# Altium project SM2200-PCB-2.PrjPCB
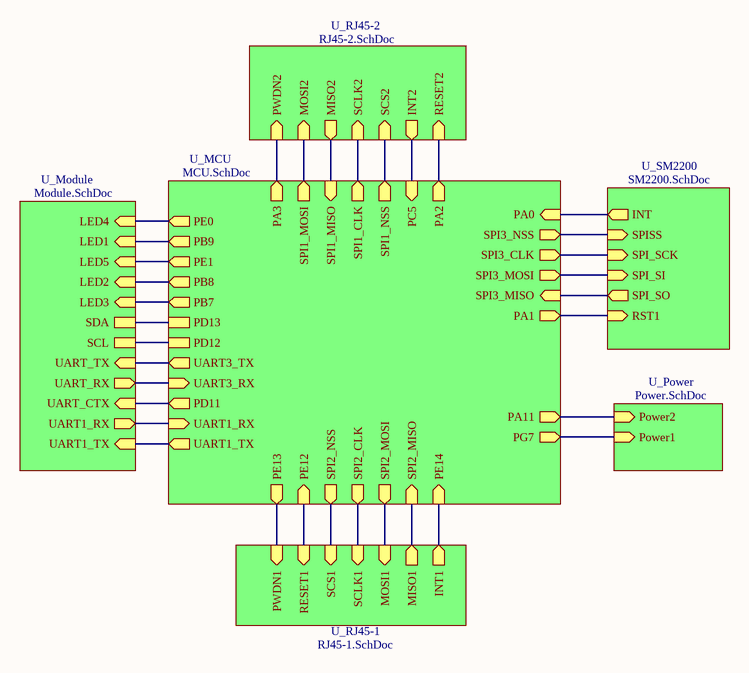
[diagram p0: Top.SchDoc]
7 sheets, 308 parts. Net scope: hierarchical (ports join the sheet entries above them; power ports are global).
Board file: Board.PcbDoc
Sheets:
  Top.SchDoc
    U_MCU = MCU.SchDoc
    U_Module = Module.SchDoc
    U_Power = Power.SchDoc
    U_RJ45-1 = RJ45-1.SchDoc
    U_RJ45-2 = RJ45-2.SchDoc
    U_SM2200 = SM2200.SchDoc

## Sheet Top.SchDoc
size A4

### Sub-sheets
U_MCU = MCU.SchDoc: SPI1_NSS (out), SPI1_CLK (out), SPI1_MISO (in), SPI1_MOSI (out), SPI2_NSS (out), SPI2_CLK (out), SPI2_MISO (in), SPI2_MOSI (out), PA3 (out), PC5 (in), PE14 (in), PE13 (out), PE12 (in), PA2 (out), PA1 (out), PA0 (in), UART1_TX (out), UART1_RX (in), UART3_TX (out), UART3_RX (in), PD11 (out), PD13, PD12, PG7 (out), PA11 (out), PE1 (out), PE0 (out), PB9 (out), PB8 (out), PB7 (out), SPI3_CLK (out), SPI3_MOSI (out), SPI3_NSS (out), SPI3_MISO (in)
U_Module = Module.SchDoc: UART_RX (out), UART_TX (in), UART_CTX (in), SCL, SDA, UART1_TX (in), UART1_RX (out), LED1 (in), LED2 (in), LED3 (in), LED4 (in), LED5 (in)
U_Power = Power.SchDoc: Power1 (in), Power2 (in)
U_RJ45-1 = RJ45-1.SchDoc: INT1 (out), SCS1 (in), SCLK1 (in), MOSI1 (in), MISO1 (out), PWDN1 (in), RESET1 (in)
U_RJ45-2 = RJ45-2.SchDoc: INT2 (out), SCS2 (in), SCLK2 (in), MOSI2 (in), MISO2 (out), PWDN2 (in), RESET2 (in)
U_SM2200 = SM2200.SchDoc: SPISS (in), SPI_SCK (in), SPI_SI (in), SPI_SO (out), RST1 (in), INT (out)

### Nets
INT: sheet U_MCU/PA0, sheet U_SM2200/INT
INT1: sheet U_MCU/PE14, sheet U_RJ45-1/INT1
INT2: sheet U_MCU/PC5, sheet U_RJ45-2/INT2
MISO1: sheet U_MCU/SPI2_MISO, sheet U_RJ45-1/MISO1
MISO2: sheet U_MCU/SPI1_MISO, sheet U_RJ45-2/MISO2
MOSI1: sheet U_MCU/SPI2_MOSI, sheet U_RJ45-1/MOSI1
MOSI2: sheet U_MCU/SPI1_MOSI, sheet U_RJ45-2/MOSI2
PWDN1: sheet U_MCU/PE13, sheet U_RJ45-1/PWDN1
PWDN2: sheet U_MCU/PA3, sheet U_RJ45-2/PWDN2
RESET1: sheet U_MCU/PE12, sheet U_RJ45-1/RESET1
RESET2: sheet U_MCU/PA2, sheet U_RJ45-2/RESET2
RST1: sheet U_MCU/PA1, sheet U_SM2200/RST1
SCLK1: sheet U_MCU/SPI2_CLK, sheet U_RJ45-1/SCLK1
SCLK2: sheet U_MCU/SPI1_CLK, sheet U_RJ45-2/SCLK2
SCS1: sheet U_MCU/SPI2_NSS, sheet U_RJ45-1/SCS1
SCS2: sheet U_MCU/SPI1_NSS, sheet U_RJ45-2/SCS2
SPI3_CLK: sheet U_MCU/SPI3_CLK, sheet U_SM2200/SPI_SCK
SPI3_MISO: sheet U_MCU/SPI3_MISO, sheet U_SM2200/SPI_SO
SPI3_MOSI: sheet U_MCU/SPI3_MOSI, sheet U_SM2200/SPI_SI
SPI3_NSS: sheet U_MCU/SPI3_NSS, sheet U_SM2200/SPISS
NetR10_2: sheet U_MCU/PD12, sheet U_Module/SCL
NetR11_1: sheet U_MCU/UART3_RX, sheet U_Module/UART_RX
NetR13_2: sheet U_MCU/PD13, sheet U_Module/SDA
NetR15_2: sheet U_MCU/PD11, sheet U_Module/UART_CTX
NetR18_1: sheet U_MCU/UART3_TX, sheet U_Module/UART_TX
NetR23_2: sheet U_MCU/PB7, sheet U_Module/LED3
NetR24_2: sheet U_MCU/PE0, sheet U_Module/LED4
NetR25_2: sheet U_MCU/PB9, sheet U_Module/LED1
NetR26_2: sheet U_MCU/PB8, sheet U_Module/LED2
NetR27_1: sheet U_MCU/UART1_TX, sheet U_Module/UART1_TX
NetR28_1: sheet U_MCU/UART1_RX, sheet U_Module/UART1_RX
NetR30_2: sheet U_MCU/PE1, sheet U_Module/LED5
NetR38_2: sheet U_MCU/PG7, sheet U_Power/Power1
NetR40_2: sheet U_MCU/PA11, sheet U_Power/Power2

## Sheet MCU.SchDoc
size A4
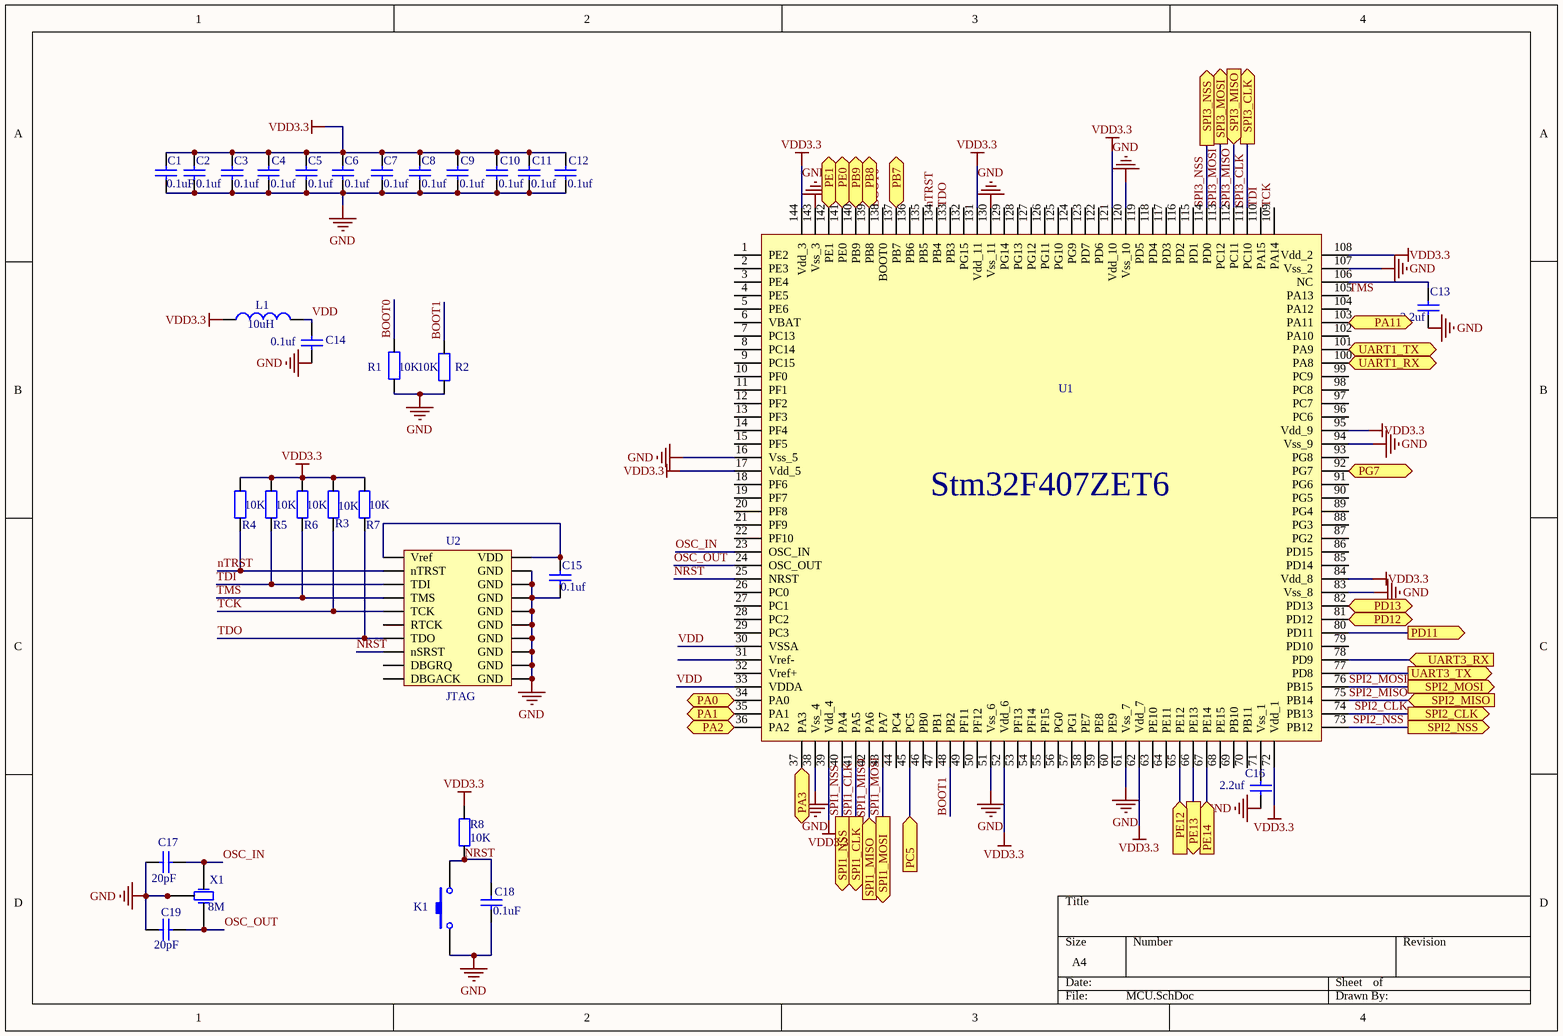
[diagram p1: MCU.SchDoc]

### Parts
C1  value 0.1uF  [0603]  (hidden comment: Capacitor-0805)
C2  value 0.1uf  [0603]  (hidden comment: Capacitor-0805)
C3  value 0.1uf  [0603]  (hidden comment: Capacitor-0805)
C4  value 0.1uf  [0603]  (hidden comment: Capacitor-0805)
C5  value 0.1uf  [0603]  (hidden comment: Capacitor-0805)
C6  value 0.1uf  [0603]  (hidden comment: Capacitor-0805)
C7  value 0.1uf  [0603]  (hidden comment: Capacitor-0805)
C8  value 0.1uf  [0603]  (hidden comment: Capacitor-0805)
C9  value 0.1uf  [0603]  (hidden comment: Capacitor-0805)
C10  value 0.1uf  [0603]  (hidden comment: Capacitor-0805)
C11  value 0.1uf  [0603]  (hidden comment: Capacitor-0805)
C12  value 0.1uf  [0603]  (hidden comment: Capacitor-0805)
C13  value 2.2uf  [0603]  (hidden comment: Capacitor-0603)
C14  value 0.1uf  [0603]  (hidden comment: Capacitor-0805)
C15  value 0.1uf  [0603]  (hidden comment: Capacitor-0805)
C16  value 2.2uf  [0603]  (hidden comment: Capacitor-0603)
C17  value 20pF  [0603]  (hidden comment: Capacitor-0805)
C18  value 0.1uF  [0603]  (hidden comment: Capacitor-0805)
C19  value 20pF  [0603]  (hidden comment: Capacitor-0805)
K1  按键  [贴片按键]  (value not drawn)
L1  value 10uH  [0805]  (hidden comment: Inductor)
R1  value 10K  [0603]  (hidden comment: Resistor-0805)
R2  value 10K  [0603]  (hidden comment: Resistor-0805)
R3  value 10K  [0603]  (hidden comment: Resistor-0805)
R4  value 10K  [0603]  (hidden comment: Resistor-0805)
R5  value 10K  [0603]  (hidden comment: Resistor-0805)
R6  value 10K  [0603]  (hidden comment: Resistor-0805)
R7  value 10K  [0603]  (hidden comment: Resistor-0805)
R8  value 10K  [0603]  (hidden comment: Resistor-0805)
U1  STM32F407ZET6  [Stm32f407ZET6 - duplicate]  (value not drawn)
U2  JTAG  [JTAG-20]
X1  value 8M  [3225无源晶振]  (hidden comment: 3225无源晶振)

### Ports
PA0 (in), PA1 (out), PA2 (out), PA3 (out), PA11 (out), PB7 (out), PB8 (out), PB9 (out), PC5 (in), PD11 (out), PD12, PD13, PE0 (out), PE1 (out), PE12 (in), PE13 (out), PE14 (in), PG7 (out), SPI1_CLK (out), SPI1_MISO (in), SPI1_MOSI (out), SPI1_NSS (out), SPI2_CLK (out), SPI2_MISO (in), SPI2_MOSI (out), SPI2_NSS (out), SPI3_CLK (out), SPI3_MISO (in), SPI3_MOSI (out), SPI3_NSS (out), UART1_RX (in), UART1_TX (out), UART3_RX (in), UART3_TX (out)

### Nets
GND: C1.1 C2.1 C3.1 C4.1 C5.1 C6.1 C7.1 C8.1 C9.1 C10.1 C11.1 C12.1 C13.1 C14.1 C15.1 C16.1 C17.1 C18.1 C19.1 K1.1 R1.1 R2.1 U1.16(Vss_5) U1.38(Vss_4) U1.51(Vss_6) U1.61(Vss_7) U1.83(Vss_8) U1.94(Vss_9) U1.107(Vss_2) U1.120(Vss_10) U1.130(Vss_11) U1.143(Vss_3) U2.4(GND) U2.6(GND) U2.8(GND) U2.10(GND) U2.12(GND) U2.14(GND) U2.16(GND) U2.18(GND) U2.20(GND) X1.2(GND) X1.4(GND)
VDD3.3: C1.2 C2.2 C3.2 C4.2 C5.2 C6.2 C7.2 C8.2 C9.2 C10.2 C11.2 C12.2 L1.1 R3.2 R4.2 R5.2 R6.2 R7.2 R8.2 U1.17(Vdd_5) U1.39(Vdd_4) U1.52(Vdd_6) U1.62(Vdd_7) U1.72(Vdd_1) U1.84(Vdd_8) U1.95(Vdd_9) U1.108(Vdd_2) U1.121(Vdd_10) U1.131(Vdd_11) U1.144(Vdd_3)
BOOT0: R1.2 U1.138(BOOT0)
BOOT1: R2.2 U1.48(PB2)
INT: U1.34(PA0) ; port PA0
INT1: U1.67(PE14) ; port PE14
INT2: U1.45(PC5) ; port PC5
NRST: C18.2 K1.2 R8.1 U1.25(NRST) U2.15(nSRST)
nTRST: R4.1 U1.134(PB4) U2.3(nTRST)
OSC_IN: C17.2 U1.23(OSC_IN) X1.1(OSC1)
OSC_OUT: C19.2 U1.24(OSC_OUT) X1.3(OSC2)
PWDN1: U1.66(PE13) ; port PE13
PWDN2: U1.37(PA3) ; port PA3
RESET1: U1.65(PE12) ; port PE12
RESET2: U1.36(PA2) ; port PA2
RST1: U1.35(PA1) ; port PA1
SPI1_CLK: U1.41(PA5) ; port SPI1_CLK  [project net SCLK2]
SPI1_MISO: U1.42(PA6) ; port SPI1_MISO  [project net MISO2]
SPI1_MOSI: U1.43(PA7) ; port SPI1_MOSI  [project net MOSI2]
SPI1_NSS: U1.40(PA4) ; port SPI1_NSS  [project net SCS2]
SPI2_CLK: U1.74(PB13) ; port SPI2_CLK  [project net SCLK1]
SPI2_MISO: U1.75(PB14) ; port SPI2_MISO  [project net MISO1]
SPI2_MOSI: U1.76(PB15) ; port SPI2_MOSI  [project net MOSI1]
SPI2_NSS: U1.73(PB12) ; port SPI2_NSS  [project net SCS1]
SPI3_CLK: U1.111(PC10) ; port SPI3_CLK
SPI3_MISO: U1.112(PC11) ; port SPI3_MISO
SPI3_MOSI: U1.113(PC12) ; port SPI3_MOSI
SPI3_NSS: U1.114(PD0) ; port SPI3_NSS
TCK: R3.1 U1.109(PA14) U2.9(TCK)
TDI: R5.1 U1.110(PA15) U2.5(TDI)
TDO: R7.1 U1.133(PB3) U2.13(TDO)
TMS: R6.1 U1.105(PA13) U2.7(TMS)
VDD: C14.2 L1.2 U1.30(VSSA) U1.33(VDDA)
NetC13_2: C13.2 U1.106(NC)
NetC15_2: C15.2 U2.1(Vref) U2.2(VDD)
NetC16_2: C16.2 U1.71(Vss_1)
NetR10_2: U1.81(PD12) ; port PD12
NetR11_1: U1.78(PD9) ; port UART3_RX
NetR13_2: U1.82(PD13) ; port PD13
NetR15_2: U1.80(PD11) ; port PD11
NetR18_1: U1.77(PD8) ; port UART3_TX
NetR23_2: U1.137(PB7) ; port PB7
NetR24_2: U1.141(PE0) ; port PE0
NetR25_2: U1.140(PB9) ; port PB9
NetR26_2: U1.139(PB8) ; port PB8
NetR27_1: U1.101(PA9) ; port UART1_TX
NetR28_1: U1.100(PA8) ; port UART1_RX
NetR30_2: U1.142(PE1) ; port PE1
NetR38_2: U1.92(PG7) ; port PG7
NetR40_2: U1.103(PA11) ; port PA11

Not connected (* = marked no-connect by the designer): U1 1(PE2) 2(PE3) 3(PE4) 4(PE5) 5(PE6) 6(VBAT) 7(PC13) 8(PC14) 9(PC15) 10(PF0) 11(PF1) 12(PF2) 13(PF3) 14(PF4) 15(PF5) 18(PF6) 19(PF7) 20(PF8) 21(PF9) 22(PF10) 26(PC0) 27(PC1) 28(PC2) 29(PC3) 31(Vref-) 32(Vref+) 44(PC4) 46(PB0) 47(PB1) 49(PF11) 50(PF12) 53(PF13) 54(PF14) 55(PF15) 56(PG0) 57(PG1) 58(PE7) 59(PE8) 60(PE9) 63(PE10) 64(PE11) 68(PE15) 69(PB10) 70(PB11) 79(PD10) 85(PD14) 86(PD15) 87(PG2) 88(PG3) 89(PG4) 90(PG5) 91(PG6) 93(PG8) 96(PC6) 97(PC7) 98(PC8) 99(PC9) 102(PA10) 104(PA12) 115(PD1) 116(PD2) 117(PD3) 118(PD4) 119(PD5) 122(PD6) 123(PD7) 124(PG9) 125(PG10) 126(PG11) 127(PG12) 128(PG13) 129(PG14) 132(PG15) 135(PB5) 136(PB6); U2 11(RTCK) 17(DBGRQ) 19(DBGACK)

### Notes on the sheet
- (in symbol STM32F407Z) Stm32F407ZET6

### Library data of the parts
C1-C12 C14 C15 = Capacitor
C17-C19 = Capacitor-0
L1 = Ind
R1 R2 = Resistor
R3-R8 = Resistor-0
U1 = STM32F407Z: Value: STM32F407ZGT6
U2 = J: Value: JTAG

## Sheet Module.SchDoc
size A4
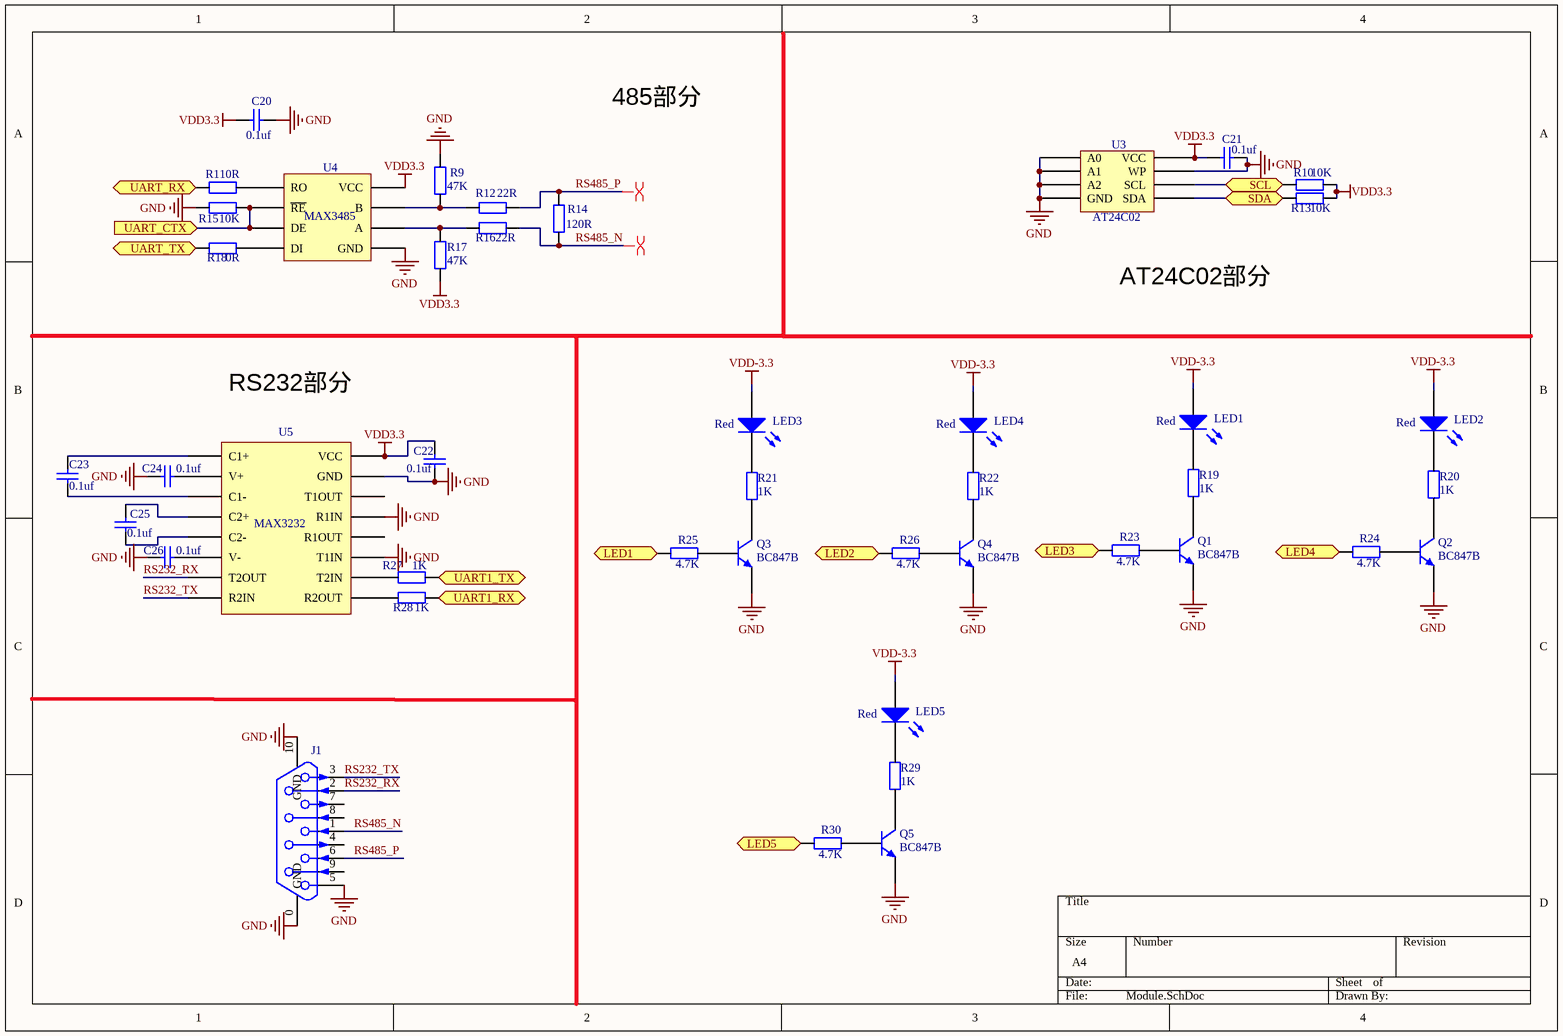
[diagram p2: Module.SchDoc]

### Parts
C20  value 0.1uf  [0603]  (hidden comment: Capacitor-0603)
C21  value 0.1uf  [0603]  (hidden comment: Capacitor-0603)
C22  value 0.1uf  [0603]  (hidden comment: Capacitor-0603)
C23  value 0.1uf  [0603]  (hidden comment: Capacitor-0603)
C24  value 0.1uf  [0603]  (hidden comment: Capacitor-0603)
C25  value 0.1uf  [0603]  (hidden comment: Capacitor-0603)
C26  value 0.1uf  [0603]  (hidden comment: Capacitor-0603)
J1  DB9  [DB9]  (value not drawn)
LED1  Color: Red  [外插小灯]  (hidden comment: LED)
LED2  Color: Red  [外插小灯]  (hidden comment: LED)
LED3  Color: Red  [外插小灯]  (hidden comment: LED)
LED4  Color: Red  [外插小灯]  (hidden comment: LED)
LED5  Color: Red  [外插小灯]  (hidden comment: LED)
Q1  BC847  [BC847B]  (value not drawn)
Q2  BC847  [BC847B]  (value not drawn)
Q3  BC847  [BC847B]  (value not drawn)
Q4  BC847  [BC847B]  (value not drawn)
Q5  BC847  [BC847B]  (value not drawn)
R9  value 47K  [0603]  (hidden comment: Resistor-0603)
R10  value 10K  [0603]  (hidden comment: Resistor-0603)
R11  value 0R  [0603]  (hidden comment: Resistor-0603)
R12  value 22R  [0603]  (hidden comment: Resistor-0603)
R13  value 10K  [0603]  (hidden comment: Resistor-0603)
R14  value 120R  [0603]  (hidden comment: Resistor-0603)
R15  value 10K  [0603]  (hidden comment: Resistor-0603)
R16  value 22R  [0603]  (hidden comment: Resistor-0603)
R17  value 47K  [0603]  (hidden comment: Resistor-0603)
R18  value 0R  [0603]  (hidden comment: Resistor-0603)
R19  value 1K  [0603]  (hidden comment: Resistor-0603)
R20  value 1K  [0603]  (hidden comment: Resistor-0603)
R21  value 1K  [0603]  (hidden comment: Resistor-0603)
R22  value 1K  [0603]  (hidden comment: Resistor-0603)
R23  value 4.7K  [0603]  (hidden comment: Resistor-0603)
R24  value 4.7K  [0603]  (hidden comment: Resistor-0603)
R25  value 4.7K  [0603]  (hidden comment: Resistor-0603)
R26  value 4.7K  [0603]  (hidden comment: Resistor-0603)
R27  value 1K  [0603]  (hidden comment: Resistor-0603)
R28  value 1K  [0603]  (hidden comment: Resistor-0603)
R29  value 1K  [0603]  (hidden comment: Resistor-0603)
R30  value 4.7K  [0603]  (hidden comment: Resistor-0603)
U3  AT24C02  [AT24C02]
U4  MAX3485  [MAX3485]
U5  MAX3232  [MAX3232]

### Ports
LED1 (in), LED2 (in), LED3 (in), LED4 (in), LED5 (in), SCL, SDA, UART1_RX (out), UART1_TX (in), UART_CTX (in), UART_RX (out), UART_TX (in)

### Nets
GND: C20.2 C21.1 C22.1 C24.2 C26.2 J1.0(GND) J1.5 J1.10(GND) Q1.1(E) Q2.1(E) Q3.1(E) Q4.1(E) Q5.1(E) R9.2 R15.1 U3.1(A0) U3.2(A1) U3.3(A2) U3.4(GND) U3.7(WP) U4.5(GND) U5.11(T1IN) U5.13(R1IN) U5.15(GND)
VDD3.3: C20.1 C21.2 C22.2 R10.1 R13.1 R17.1 U3.8(VCC) U4.8(VCC) U5.16(VCC)
VDD-3.3: LED1.1(A) LED2.1(A) LED3.1(A) LED4.1(A) LED5.1(A)
RS232_RX: J1.2 U5.7(T2OUT)
RS232_TX: J1.3 U5.8(R2IN)
RS485_N: J1.1 R14.2 R16.1
RS485_P: J1.6 R12.1 R14.1
NetC23_1: C23.1 U5.3(C1-)
NetC23_2: C23.2 U5.1(C1+)
NetC24_1: C24.1 U5.2(V+)
NetC25_1: C25.1 U5.5(C2-)
NetC25_2: C25.2 U5.4(C2+)
NetC26_1: C26.1 U5.6(V-)
NetLED1_2: LED1.2 R19.2
NetLED2_2: LED2.2 R20.2
NetLED3_2: LED3.2 R21.2
NetLED4_2: LED4.2 R22.2
NetLED5_2: LED5.2 R29.2
NetQ1_2: Q1.2(B) R23.1
NetQ1_3: Q1.3(C) R19.1
NetQ2_2: Q2.2(B) R24.1
NetQ2_3: Q2.3(C) R20.1
NetQ3_2: Q3.2(B) R25.1
NetQ3_3: Q3.3(C) R21.1
NetQ4_2: Q4.2(B) R26.1
NetQ4_3: Q4.3(C) R22.1
NetQ5_2: Q5.2(B) R30.1
NetQ5_3: Q5.3(C) R29.1
NetR9_1: R9.1 R12.2 U4.7(B)
NetR10_2: R10.2 U3.6(SCL) ; port SCL
NetR11_1: R11.1 ; port UART_RX
NetR11_2: R11.2 U4.1(RO)
NetR13_2: R13.2 U3.5(SDA) ; port SDA
NetR15_2: R15.2 U4.2(~{RE}) U4.3(DE) ; port UART_CTX
NetR16_2: R16.2 R17.2 U4.6(A)
NetR18_1: R18.1 ; port UART_TX
NetR18_2: R18.2 U4.4(DI)
NetR23_2: R23.2 ; port LED3
NetR24_2: R24.2 ; port LED4
NetR25_2: R25.2 ; port LED1
NetR26_2: R26.2 ; port LED2
NetR27_1: R27.1 ; port UART1_TX
NetR27_2: R27.2 U5.10(T2IN)
NetR28_1: R28.1 ; port UART1_RX
NetR28_2: R28.2 U5.9(R2OUT)
NetR30_2: R30.2 ; port LED5

Not connected (* = marked no-connect by the designer): J1 4 7 8 9; U5 12(R1OUT) 14(T1OUT)

### Layout directives
differential pair: RS485_N, RS485_P

### Notes on the sheet
- 485部分
- AT24C02部分
- RS232部分

### Library data of the parts
LED1-LED5 = LED: Value: LED
Q1-Q5 = BC847: Name: BC847B
U3 = AT24C02: Name: AT24C02
U4 = MAX3485: Name: MAX3485
U5 = MAX3232: Name: MAX3232

## Sheet Power.SchDoc
size A4
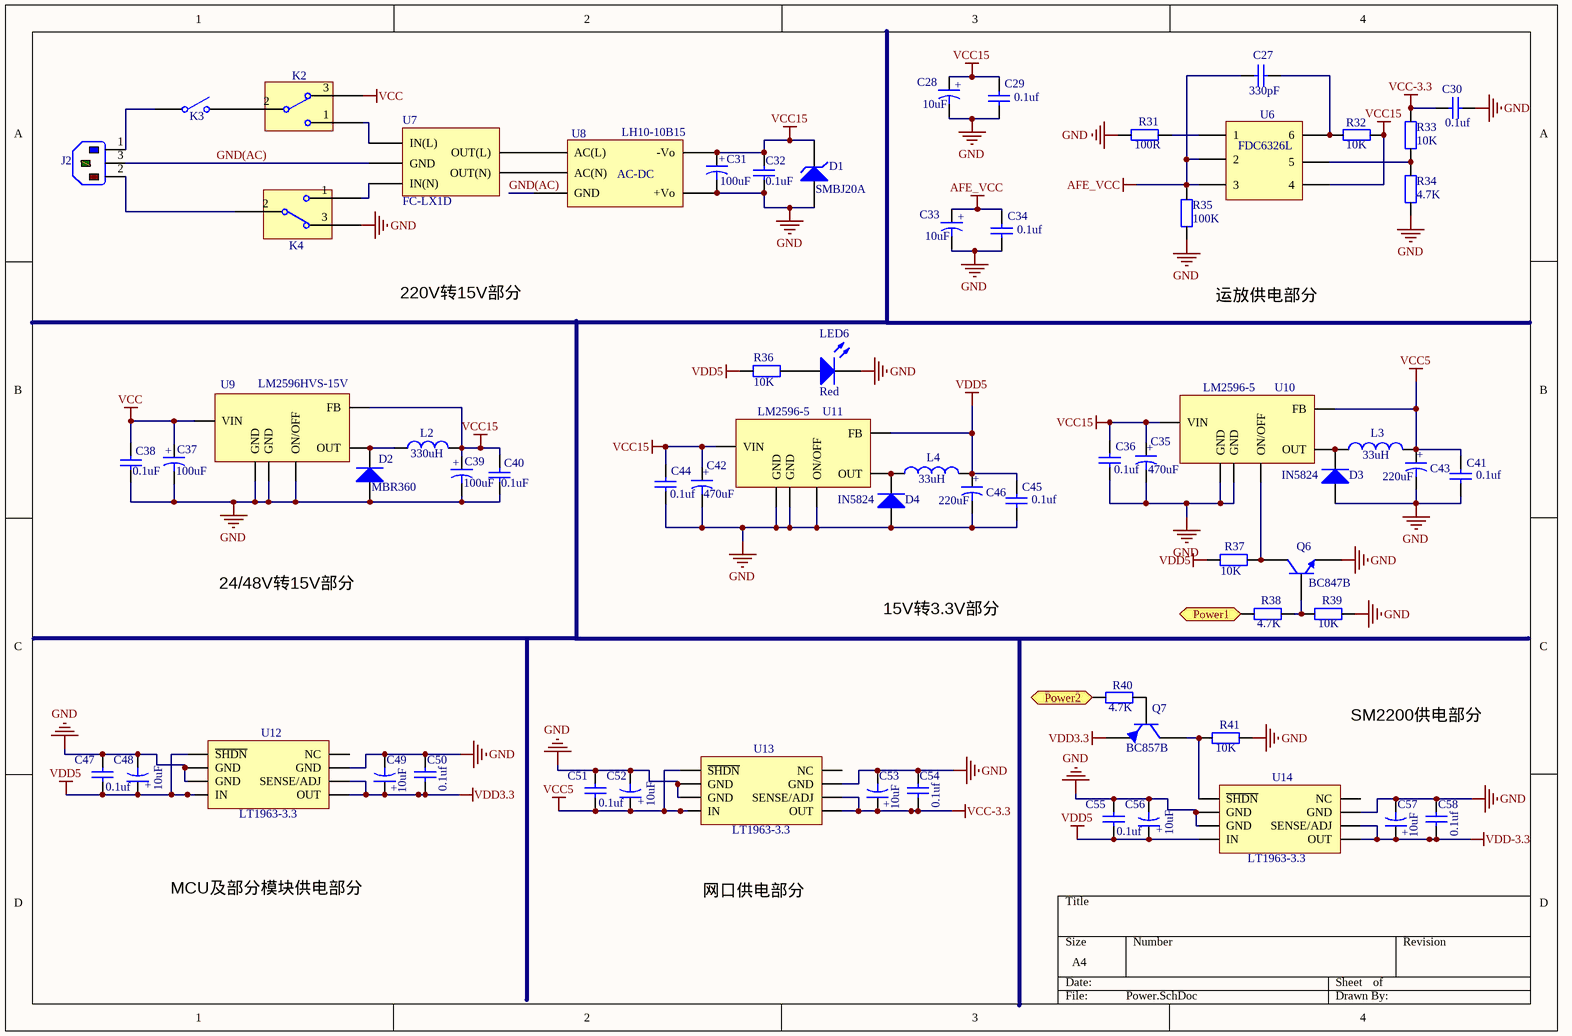
[diagram p3: Power.SchDoc]

### Parts
C27  value 330pF  [0603]  (hidden comment: Capacitor-0805)
C28  value 10uF  [3528]  (hidden comment: 电解电容)
C29  value 0.1uf  [0805]  (hidden comment: Capacitor-0805)
C30  value 0.1uf  [0603]  (hidden comment: Capacitor-0805)
C31  value 100uF  [贴片铝电容-8*10.3]  (hidden comment: 电解电容)
C32  value 0.1uF  [0805]  (hidden comment: Capacitor-0805)
C33  value 10uF  [3528]  (hidden comment: 电解电容)
C34  value 0.1uf  [0805]  (hidden comment: Capacitor-0805)
C35  value 470uF  [贴片铝电容-10*10]  (hidden comment: 电解电容)
C36  value 0.1uf  [0805]  (hidden comment: Capacitor-0805)
C37  value 100uF  [贴片铝电容-8*10.3]  (hidden comment: 电解电容)
C38  value 0.1uF  [0805]  (hidden comment: Capacitor-0805)
C39  value 100uF  [贴片铝电容-8*10.3]  (hidden comment: 电解电容)
C40  value 0.1uF  [0805]  (hidden comment: Capacitor-0805)
C41  value 0.1uf  [0805]  (hidden comment: Capacitor-0805)
C42  value 470uF  [贴片铝电容-10*10]  (hidden comment: 电解电容)
C43  value 220uF  [贴片铝电容-8*10.3]  (hidden comment: 电解电容)
C44  value 0.1uf  [0805]  (hidden comment: Capacitor-0805)
C45  value 0.1uf  [0805]  (hidden comment: Capacitor-0805)
C46  value 220uF  [贴片铝电容-8*10.3]  (hidden comment: 电解电容)
C47  value 0.1uf  [0805]  (hidden comment: Capacitor-0805)
C48  value 10uF  [钽电容1206（A3216）]  (hidden comment: 电解电容)
C49  value 10uF  [钽电容1206（A3216）]  (hidden comment: 电解电容)
C50  value 0.1uf  [0805]  (hidden comment: Capacitor-0805)
C51  value 0.1uf  [0805]  (hidden comment: Capacitor-0805)
C52  value 10uF  [钽电容1206（A3216）]  (hidden comment: 电解电容)
C53  value 10uF  [钽电容1206（A3216）]  (hidden comment: 电解电容)
C54  value 0.1uf  [0805]  (hidden comment: Capacitor-0805)
C55  value 0.1uf  [0805]  (hidden comment: Capacitor-0805)
C56  value 10uF  [钽电容1206（A3216）]  (hidden comment: 电解电容)
C57  value 10uF  [钽电容1206（A3216）]  (hidden comment: 电解电容)
C58  value 0.1uf  [0805]  (hidden comment: Capacitor-0805)
D1  SMBJ20A  [SMBJ20A]
D2  value MBR360  [IN5824]  (hidden comment: IN5824)
D3  IN5824  [IN5824]
D4  IN5824  [IN5824]
J2  三脚航空插头  [三脚航空插头]  (value not drawn)
K2  选择开关  [选择开关]  (value not drawn)
K3  开关  [T型接头]  (value not drawn)
K4  选择开关  [选择开关]  (value not drawn)
L2  value 330uH  [Inductor(7.8*7*5)]  (hidden comment: Inductor)
L3  value 33uH  [SLF6025   电感]  (hidden comment: Inductor)
L4  value 33uH  [SLF6025   电感]  (hidden comment: Inductor)
LED6  Color: Red  [外插小灯]  (hidden comment: LED)
Q6  BC847  [BC847B]  (value not drawn)
Q7  Name: BC857B  [BC847B]  (hidden comment: BC587B)
R31  value 100R  [0603]  (hidden comment: Resistor-0603)
R32  value 10K  [0603]  (hidden comment: Resistor-0603)
R33  value 10K  [0603]  (hidden comment: Resistor-0603)
R34  value 4.7K  [0603]  (hidden comment: Resistor-0603)
R35  value 100K  [0603]  (hidden comment: Resistor-0603)
R36  value 10K  [0603]  (hidden comment: Resistor-0603)
R37  value 10K  [0603]  (hidden comment: Resistor-0603)
R38  value 4.7K  [0603]  (hidden comment: Resistor-0603)
R39  value 10K  [0603]  (hidden comment: Resistor-0603)
R40  value 4.7K  [0603]  (hidden comment: Resistor-0603)
R41  value 10K  [0603]  (hidden comment: Resistor-0603)
U6  FDC6326L  [FDC6326L]
U7  FC-LX1D  [FC-LX1D]
U8  Describe: AC-DC  [LH10-10B15]  (hidden comment: LH10-10B15)
U9  value LM2596HVS-15V  [LM2596]  (hidden comment: LM2596)
U10  LM2596  [LM2596]  (value not drawn)
U11  LM2596  [LM2596]  (value not drawn)
U12  LT1963  [LT1963]  (value not drawn)
U13  LT1963  [LT1963]  (value not drawn)
U14  LT1963  [LT1963]  (value not drawn)

### Ports
Power1 (in), Power2 (in)

### Nets
AFE_VCC: C27.2 C33.2 C34.2 R35.2 U6.2 U6.3
GND: C28.1 C29.1 C30.1 C31.1 C32.1 C33.1 C34.1 C35.1 C36.1 C37.1 C38.1 C39.1 C40.1 C41.1 C42.1 C43.1 C44.1 C45.1 C46.1 C47.2 C48.1 C49.1 C50.2 C51.2 C52.1 C53.1 C54.2 C55.2 C56.1 C57.1 C58.2 D1.1(A) D2.1(A) D3.1(A) D4.1(A) K4.3 LED6.2 Q6.1(E) R31.1 R34.1 R35.1 R39.1 R41.1 U8.8(+Vo) U9.3(GND) U9.5(ON/OFF) U9.6(GND) U10.3(GND) U10.6(GND) U11.3(GND) U11.5(ON/OFF) U11.6(GND) U12.3(GND) U12.6(GND) U12.7(GND) U13.3(GND) U13.6(GND) U13.7(GND) U14.3(GND) U14.6(GND) U14.7(GND)
VCC: C37.2 C38.2 K2.3 U9.1(VIN)
VCC5: C41.2 C43.2 C51.1 C52.2 L3.2 U10.4(FB) U13.5(~{SHDN}) U13.8(IN)
VCC15: C28.2 C29.2 C31.2 C32.2 C35.2 C36.2 C39.2 C40.2 C42.2 C44.2 D1.2(K) L2.2 R32.1 U6.4 U8.4(-Vo) U9.4(FB) U10.1(VIN) U11.1(VIN)
VCC-3.3: C30.2 C53.2 C54.1 R33.2 U13.1(OUT) U13.2(SENSE/ADJ)
VDD3.3: C49.2 C50.1 Q7.1(E) U12.1(OUT) U12.2(SENSE/ADJ)
VDD5: C45.2 C46.2 C47.1 C48.2 C55.1 C56.2 L4.2 R36.2 R37.1 U11.4(FB) U12.5(~{SHDN}) U12.8(IN) U14.8(IN)
VDD-3.3: C57.2 C58.1 U14.1(OUT) U14.2(SENSE/ADJ)
GND(AC): J2.3 U7.1(GND) U8.1(GND)
NetC27_1: C27.1 R32.2 U6.6
NetD2_2: D2.2(K) L2.1 U9.2(OUT)
NetD3_2: D3.2(K) L3.1 U10.2(OUT)
NetD4_2: D4.2(K) L4.1 U11.2(OUT)
NetJ2_1: J2.1 K3.1(COMMON)
NetJ2_2: J2.2 K4.2
NetK2_1: K2.1 U7.3(IN(L))
NetK2_2: K2.2 K3.2(NO)
NetK4_1: K4.1 U7.2(IN(N))
NetLED6_1: LED6.1(A) R36.1
NetQ6_2: Q6.2(B) R38.1 R39.2
NetQ6_3: Q6.3(C) R37.2 U10.5(ON/OFF)
NetQ7_2: Q7.2(B) R40.1
NetQ7_3: Q7.3(C) R41.2 U14.5(~{SHDN})
NetR31_2: R31.2 U6.1
NetR33_1: R33.1 R34.2 U6.5
NetR38_2: R38.2 ; port Power1
NetR40_2: R40.2 ; port Power2
NetU7_4: U7.4(OUT(L)) U8.3(AC(L))
NetU7_5: U7.5(OUT(N)) U8.2(AC(N))

Not connected (* = marked no-connect by the designer): U12 4(NC); U13 4(NC); U14 4(NC)

### Notes on the sheet
- 220V转15V部分
- 运放供电部分
- 24/48V转15V部分
- 15V转3.3V部分
- SM2200供电部分
- MCU及部分模块供电部分
- 网口供电部分
- (in symbol 电解电容) +

### Library data of the parts
C27 C29 C30 C34 C36 C41 C44 C45 C47 C50 C51 C54 C55 C58 = Capacitor
D3 D4 = I
L3 L4 = Ind
U10-U14 = L
D1 = SMBJ20A: Name: SMBJ20A
LED6 = LED: Value: LED
Q6 = BC847: Name: BC847B
U6 = FDC6326L: Name: FDC6326L
U7 = FC-LX1D: Name: FC-LX1D
U8 = LH10-10B15: Name: LH10-10B15

## Sheet RJ45-1.SchDoc
size A4
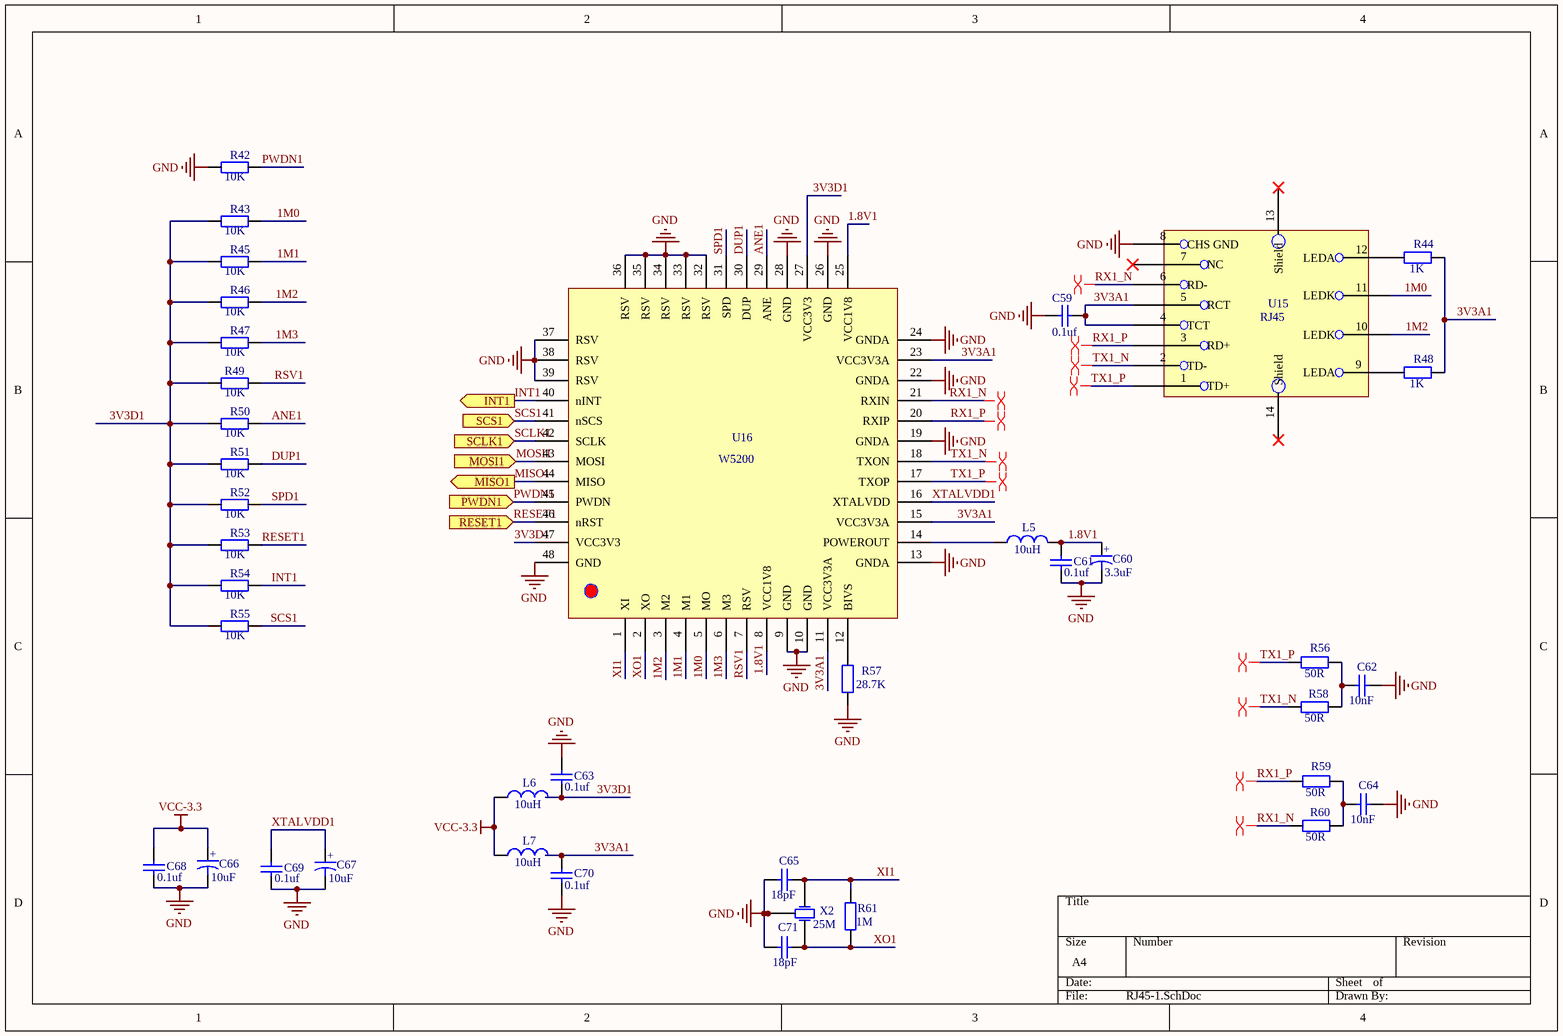
[diagram p4: RJ45-1.SchDoc]

### Parts
C59  value 0.1uf  [0603]  (hidden comment: Capacitor-0603)
C60  value 3.3uF  [钽电容1206（A3216）]  (hidden comment: 电解电容)
C61  value 0.1uf  [0603]  (hidden comment: Capacitor-0603)
C62  value 10nF  [0603]  (hidden comment: Capacitor-0603)
C63  value 0.1uf  [0603]  (hidden comment: Capacitor-0603)
C64  value 10nF  [0603]  (hidden comment: Capacitor-0603)
C65  value 18pF  [0603]  (hidden comment: Capacitor-0603)
C66  value 10uF  [钽电容1206（A3216）]  (hidden comment: 电解电容)
C67  value 10uF  [钽电容1206（A3216）]  (hidden comment: 电解电容)
C68  value 0.1uf  [0603]  (hidden comment: Capacitor-0603)
C69  value 0.1uf  [0603]  (hidden comment: Capacitor-0603)
C70  value 0.1uf  [0603]  (hidden comment: Capacitor-0603)
C71  value 18pF  [0603]  (hidden comment: Capacitor-0603)
L5  value 10uH  [0805]  (hidden comment: Inductor)
L6  value 10uH  [0805]  (hidden comment: Inductor)
L7  value 10uH  [0805]  (hidden comment: Inductor)
R42  value 10K  [0603]  (hidden comment: Resistor-0603)
R43  value 10K  [0603]  (hidden comment: Resistor-0603)
R44  value 1K  [0603]  (hidden comment: Resistor-0603)
R45  value 10K  [0603]  (hidden comment: Resistor-0603)
R46  value 10K  [0603]  (hidden comment: Resistor-0603)
R47  value 10K  [0603]  (hidden comment: Resistor-0603)
R48  value 1K  [0603]  (hidden comment: Resistor-0603)
R49  value 10K  [0603]  (hidden comment: Resistor-0603)
R50  value 10K  [0603]  (hidden comment: Resistor-0603)
R51  value 10K  [0603]  (hidden comment: Resistor-0603)
R52  value 10K  [0603]  (hidden comment: Resistor-0603)
R53  value 10K  [0603]  (hidden comment: Resistor-0603)
R54  value 10K  [0603]  (hidden comment: Resistor-0603)
R55  value 10K  [0603]  (hidden comment: Resistor-0603)
R56  value 50R  [0603]  (hidden comment: Resistor-0603)
R57  value 28.7K  [0603]  (hidden comment: Resistor-0603)
R58  value 50R  [0603]  (hidden comment: Resistor-0603)
R59  value 50R  [0603]  (hidden comment: Resistor-0603)
R60  value 50R  [0603]  (hidden comment: Resistor-0603)
R61  value 1M  [0603]  (hidden comment: Resistor-0603)
U15  RJ45  [RJ45]
U16  Name: W5200  [W5200-Chip]  (hidden comment: W5200-Chip)
X2  value 25M  [3225无源晶振]  (hidden comment: 3225无源晶振)

### Ports
INT1 (out), MISO1 (out), MOSI1 (in), PWDN1 (in), RESET1 (in), SCLK1 (in), SCS1 (in)

### Nets
GND: C59.2 C60.1 C61.1 C62.2 C63.2 C64.2 C65.1 C66.1 C67.1 C68.1 C69.1 C70.2 C71.1 R42.1 R57.1 U15.8(CHS_GND) U16.9(GND) U16.10(GND) U16.13(GNDA) U16.19(GNDA) U16.22(GNDA) U16.24(GNDA) U16.26(GND) U16.28(GND) U16.32(RSV) U16.33(RSV) U16.34(RSV) U16.35(RSV) U16.36(RSV) U16.37(RSV) U16.38(RSV) U16.39(RSV) U16.48(GND) X2.2(GND) X2.4(GND)
VCC-3.3: C66.2 C68.2 L6.1 L7.1
1.8V1: C60.2 C61.2 L5.2 U16.8(VCC1V8) U16.25(VCC1V8)
1M0: R43.2 U15.11(LEDK) U16.5(MO)
1M1: R45.2 U16.4(M1)
1M2: R46.2 U15.10(LEDK) U16.3(M2)
1M3: R47.2 U16.6(M3)
3V3A1: C59.1 C70.1 L7.2 R44.2 R48.2 U15.4(TCT) U15.5(RCT) U16.11(VCC3V3A) U16.15(VCC3V3A) U16.23(VCC3V3A)
3V3D1: C63.1 L6.2 R43.1 R45.1 R46.1 R47.1 R49.1 R50.1 R51.1 R52.1 R53.1 R54.1 R55.1 U16.27(VCC3V3) U16.47(VCC3V3)
ANE1: R50.2 U16.29(ANE)
DUP1: R51.2 U16.30(DUP)
INT1: R54.2 U16.40(nINT) ; port INT1
MISO1: U16.44(MISO) ; port MISO1
MOSI1: U16.43(MOSI) ; port MOSI1
PWDN1: R42.2 U16.45(PWDN) ; port PWDN1
RESET1: R53.2 U16.46(nRST) ; port RESET1
RSV1: R49.2 U16.7(RSV)
RX1_N: R60.1 U15.6(RD-) U16.21(RXIN)
RX1_P: R59.1 U15.3(RD+) U16.20(RXIP)
SCLK1: U16.42(SCLK) ; port SCLK1
SCS1: R55.2 U16.41(nSCS) ; port SCS1
SPD1: R52.2 U16.31(SPD)
TX1_N: R58.1 U15.2(TD-) U16.18(TXON)
TX1_P: R56.1 U15.1(TD+) U16.17(TXOP)
XI1: C65.2 R61.1 U16.1(XI) X2.1(OSC1)
XO1: C71.2 R61.2 U16.2(XO) X2.3(OSC2)
XTALVDD1: C67.2 C69.2 U16.16(XTALVDD)
NetC62_1: C62.1 R56.2 R58.2
NetC64_1: C64.1 R59.2 R60.2
NetL5_1: L5.1 U16.14(POWEROUT)
NetR44_1: R44.1 U15.12(LEDA)
NetR48_1: R48.1 U15.9(LEDA)
NetR57_2: R57.2 U16.12(BIVS)

Not connected (* = marked no-connect by the designer): U15 7(NC)* 13(Shield)* 14(Shield)*

### Layout directives
differential pair: RX1_N, RX1_P, TX1_N, TX1_P

### Notes on the sheet
- (in symbol 电解电容) +

### Library data of the parts
U15 = RJ45: Name: RJ45

## Sheet RJ45-2.SchDoc
size A4
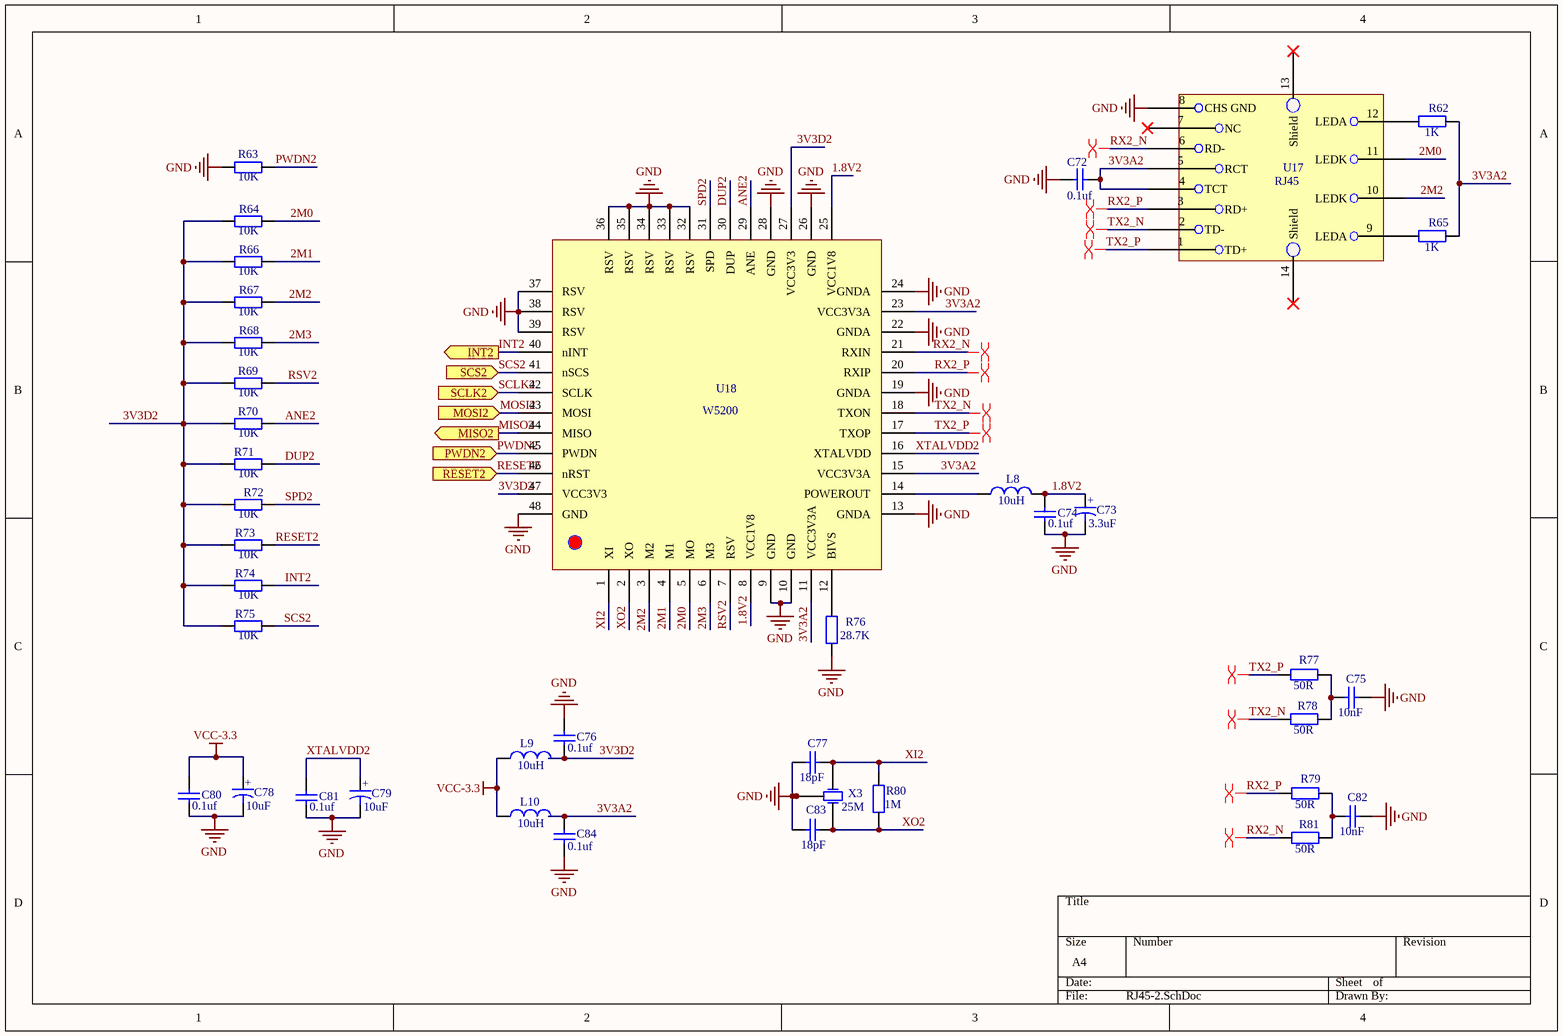
[diagram p5: RJ45-2.SchDoc]

### Parts
C72  value 0.1uf  [0603]  (hidden comment: Capacitor-0603)
C73  value 3.3uF  [钽电容1206（A3216）]  (hidden comment: 电解电容)
C74  value 0.1uf  [0603]  (hidden comment: Capacitor-0603)
C75  value 10nF  [0603]  (hidden comment: Capacitor-0603)
C76  value 0.1uf  [0603]  (hidden comment: Capacitor-0603)
C77  value 18pF  [0603]  (hidden comment: Capacitor-0603)
C78  value 10uF  [钽电容1206（A3216）]  (hidden comment: 电解电容)
C79  value 10uF  [钽电容1206（A3216）]  (hidden comment: 电解电容)
C80  value 0.1uf  [0603]  (hidden comment: Capacitor-0603)
C81  value 0.1uf  [0603]  (hidden comment: Capacitor-0603)
C82  value 10nF  [0603]  (hidden comment: Capacitor-0603)
C83  value 18pF  [0603]  (hidden comment: Capacitor-0603)
C84  value 0.1uf  [0603]  (hidden comment: Capacitor-0603)
L8  value 10uH  [0805]  (hidden comment: Inductor)
L9  value 10uH  [0805]  (hidden comment: Inductor)
L10  value 10uH  [0805]  (hidden comment: Inductor)
R62  value 1K  [0603]  (hidden comment: Resistor-0603)
R63  value 10K  [0603]  (hidden comment: Resistor-0603)
R64  value 10K  [0603]  (hidden comment: Resistor-0603)
R65  value 1K  [0603]  (hidden comment: Resistor-0603)
R66  value 10K  [0603]  (hidden comment: Resistor-0603)
R67  value 10K  [0603]  (hidden comment: Resistor-0603)
R68  value 10K  [0603]  (hidden comment: Resistor-0603)
R69  value 10K  [0603]  (hidden comment: Resistor-0603)
R70  value 10K  [0603]  (hidden comment: Resistor-0603)
R71  value 10K  [0603]  (hidden comment: Resistor-0603)
R72  value 10K  [0603]  (hidden comment: Resistor-0603)
R73  value 10K  [0603]  (hidden comment: Resistor-0603)
R74  value 10K  [0603]  (hidden comment: Resistor-0603)
R75  value 10K  [0603]  (hidden comment: Resistor-0603)
R76  value 28.7K  [0603]  (hidden comment: Resistor-0603)
R77  value 50R  [0603]  (hidden comment: Resistor-0603)
R78  value 50R  [0603]  (hidden comment: Resistor-0603)
R79  value 50R  [0603]  (hidden comment: Resistor-0603)
R80  value 1M  [0603]  (hidden comment: Resistor-0603)
R81  value 50R  [0603]  (hidden comment: Resistor-0603)
U17  RJ45  [RJ45]
U18  Name: W5200  [W5200-Chip]  (hidden comment: W5200-Chip)
X3  value 25M  [3225无源晶振]  (hidden comment: 3225无源晶振)

### Ports
INT2 (out), MISO2 (out), MOSI2 (in), PWDN2 (in), RESET2 (in), SCLK2 (in), SCS2 (in)

### Nets
GND: C72.2 C73.1 C74.1 C75.2 C76.2 C77.1 C78.1 C79.1 C80.1 C81.1 C82.2 C83.1 C84.2 R63.1 R76.1 U17.8(CHS_GND) U18.9(GND) U18.10(GND) U18.13(GNDA) U18.19(GNDA) U18.22(GNDA) U18.24(GNDA) U18.26(GND) U18.28(GND) U18.32(RSV) U18.33(RSV) U18.34(RSV) U18.35(RSV) U18.36(RSV) U18.37(RSV) U18.38(RSV) U18.39(RSV) U18.48(GND) X3.2(GND) X3.4(GND)
VCC-3.3: C78.2 C80.2 L9.1 L10.1
1.8V2: C73.2 C74.2 L8.2 U18.8(VCC1V8) U18.25(VCC1V8)
2M0: R64.2 U17.11(LEDK) U18.5(MO)
2M1: R66.2 U18.4(M1)
2M2: R67.2 U17.10(LEDK) U18.3(M2)
2M3: R68.2 U18.6(M3)
3V3A2: C72.1 C84.1 L10.2 R62.2 R65.2 U17.4(TCT) U17.5(RCT) U18.11(VCC3V3A) U18.15(VCC3V3A) U18.23(VCC3V3A)
3V3D2: C76.1 L9.2 R64.1 R66.1 R67.1 R68.1 R69.1 R70.1 R71.1 R72.1 R73.1 R74.1 R75.1 U18.27(VCC3V3) U18.47(VCC3V3)
ANE2: R70.2 U18.29(ANE)
DUP2: R71.2 U18.30(DUP)
INT2: R74.2 U18.40(nINT) ; port INT2
MISO2: U18.44(MISO) ; port MISO2
MOSI2: U18.43(MOSI) ; port MOSI2
PWDN2: R63.2 U18.45(PWDN) ; port PWDN2
RESET2: R73.2 U18.46(nRST) ; port RESET2
RSV2: R69.2 U18.7(RSV)
RX2_N: R81.1 U17.6(RD-) U18.21(RXIN)
RX2_P: R79.1 U17.3(RD+) U18.20(RXIP)
SCLK2: U18.42(SCLK) ; port SCLK2
SCS2: R75.2 U18.41(nSCS) ; port SCS2
SPD2: R72.2 U18.31(SPD)
TX2_N: R78.1 U17.2(TD-) U18.18(TXON)
TX2_P: R77.1 U17.1(TD+) U18.17(TXOP)
XI2: C77.2 R80.1 U18.1(XI) X3.1(OSC1)
XO2: C83.2 R80.2 U18.2(XO) X3.3(OSC2)
XTALVDD2: C79.2 C81.2 U18.16(XTALVDD)
NetC75_1: C75.1 R77.2 R78.2
NetC82_1: C82.1 R79.2 R81.2
NetL8_1: L8.1 U18.14(POWEROUT)
NetR62_1: R62.1 U17.12(LEDA)
NetR65_1: R65.1 U17.9(LEDA)
NetR76_2: R76.2 U18.12(BIVS)

Not connected (* = marked no-connect by the designer): U17 7(NC)* 13(Shield)* 14(Shield)*

### Layout directives
differential pair: RX2_N, RX2_P, TX2_N, TX2_P

### Notes on the sheet
- (in symbol 电解电容) +

### Library data of the parts
U17 = RJ45: Name: RJ45

## Sheet SM2200.SchDoc
size 342 x 203 mm
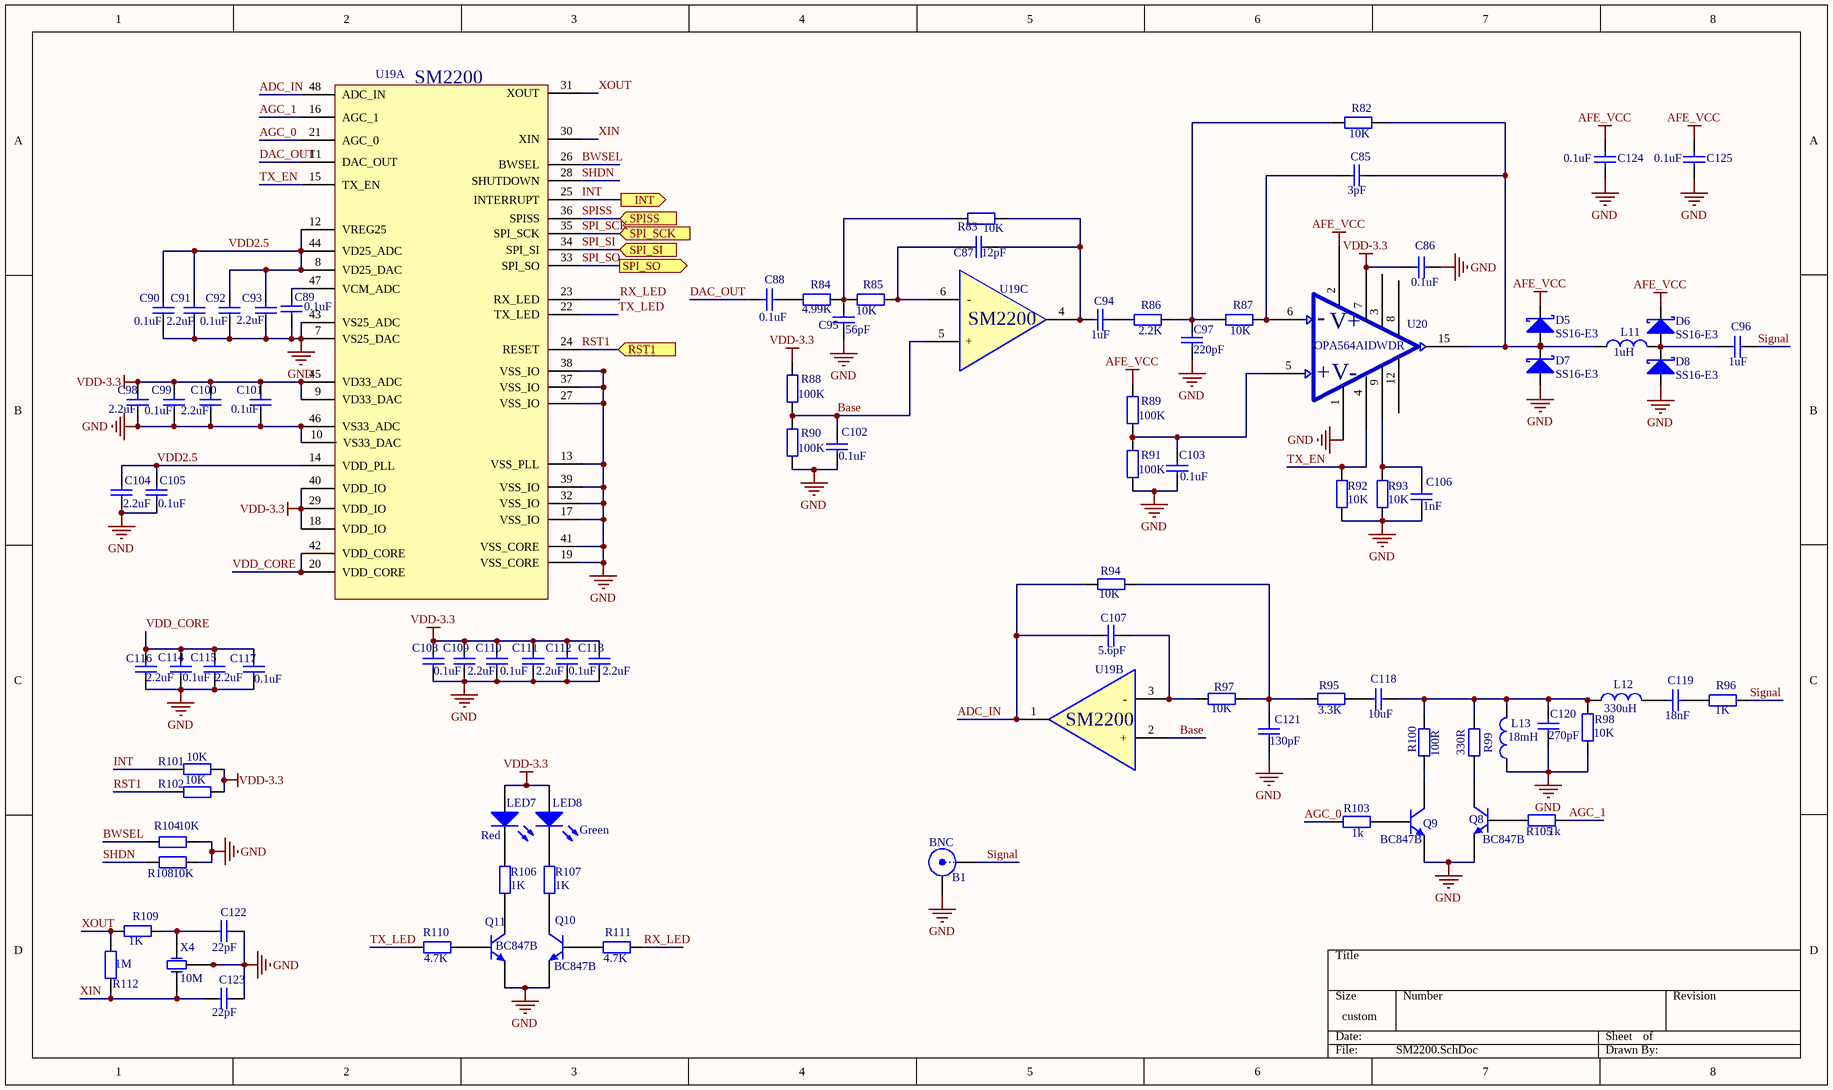
[diagram p6: SM2200.SchDoc]

### Parts
B1  BNC  [BNC]
C85  value 3pF  [0603]  (hidden comment: Capacitor-0603)
C86  value 0.1uF  [0603]  (hidden comment: Capacitor-0603)
C87  value 12pF  [0603]  (hidden comment: Capacitor-0603)
C88  value 0.1uF  [0603]  (hidden comment: Capacitor-0603)
C89  value 0.1uF  [0603]  (hidden comment: Capacitor-0805)
C90  value 0.1uF  [0603]  (hidden comment: Capacitor-0805)
C91  value 2.2uF  [0603]  (hidden comment: Capacitor-0805)
C92  value 0.1uF  [0603]  (hidden comment: Capacitor-0805)
C93  value 2.2uF  [0603]  (hidden comment: Capacitor-0805)
C94  value 1uF  [0603]  (hidden comment: Capacitor-0603)
C95  value 56pF  [0603]  (hidden comment: Capacitor-0603)
C96  value 1uF  [0603]  (hidden comment: Capacitor-0603)
C97  value 220pF  [0603]  (hidden comment: Capacitor-0603)
C98  value 2.2uF  [0603]  (hidden comment: Capacitor-0805)
C99  value 0.1uF  [0603]  (hidden comment: Capacitor-0805)
C100  value 2.2uF  [0603]  (hidden comment: Capacitor-0805)
C101  value 0.1uF  [0603]  (hidden comment: Capacitor-0805)
C102  value 0.1uF  [0603]  (hidden comment: Capacitor-0603)
C103  value 0.1uF  [0603]  (hidden comment: Capacitor-0603)
C104  value 2.2uF  [0603]  (hidden comment: Capacitor-0805)
C105  value 0.1uF  [0603]  (hidden comment: Capacitor-0805)
C106  value 1nF  [0603]  (hidden comment: Capacitor-0603)
C107  value 5.6pF  [0603]  (hidden comment: Capacitor-0603)
C108  value 0.1uF  [0603]  (hidden comment: Capacitor-0805)
C109  value 2.2uF  [0603]  (hidden comment: Capacitor-0805)
C110  value 0.1uF  [0603]  (hidden comment: Capacitor-0805)
C111  value 2.2uF  [0603]  (hidden comment: Capacitor-0805)
C112  value 0.1uF  [0603]  (hidden comment: Capacitor-0805)
C113  value 2.2uF  [0603]  (hidden comment: Capacitor-0805)
C114  value 0.1uF  [0603]  (hidden comment: Capacitor-0805)
C115  value 2.2uF  [0603]  (hidden comment: Capacitor-0805)
C116  value 2.2uF  [0603]  (hidden comment: Capacitor-0805)
C117  value 0.1uF  [0603]  (hidden comment: Capacitor-0805)
C118  value 10uF  [0805]  (hidden comment: Capacitor-0603)
C119  value 18nF  [0603]  (hidden comment: Capacitor-0603)
C120  value 270pF  [0603]  (hidden comment: Capacitor-0603)
C121  value 130pF  [0603]  (hidden comment: Capacitor-0603)
C122  value 22pF  [0603]  (hidden comment: Capacitor-0805)
C123  value 22pF  [0603]  (hidden comment: Capacitor-0805)
C124  value 0.1uF  [0603]  (hidden comment: Capacitor-0603)
C125  value 0.1uF  [0603]  (hidden comment: Capacitor-0603)
D5  Name: SS16-E3  [IN5824]  (hidden comment: SSA34)
D6  Name: SS16-E3  [IN5824]  (hidden comment: SSA34)
D7  Name: SS16-E3  [IN5824]  (hidden comment: SSA34)
D8  Name: SS16-E3  [IN5824]  (hidden comment: SSA34)
L11  value 1uH  [1206]  (hidden comment: Inductor)
L12  value 330uH  [Inductor(7.8*7*5)]  (hidden comment: Inductor)
L13  value 18mH  [工字电感0608]  (hidden comment: Inductor)
LED7  Color: Red  [外插小灯]  (hidden comment: LED)
LED8  Color: Green  [外插小灯]  (hidden comment: LED)
Q8  BC847  [BC847B]  (value not drawn)
Q9  BC847  [BC847B]  (value not drawn)
Q10  BC847  [BC847B]  (value not drawn)
Q11  BC847  [BC847B]  (value not drawn)
R82  value 10K  [0603]  (hidden comment: Resistor-0603)
R83  value 10K  [0603]  (hidden comment: Resistor-0603)
R84  value 4.99K  [0603]  (hidden comment: Resistor-0603)
R85  value 10K  [0603]  (hidden comment: Resistor-0603)
R86  value 2.2K  [0603]  (hidden comment: Resistor-0603)
R87  value 10K  [0603]  (hidden comment: Resistor-0603)
R88  value 100K  [0603]  (hidden comment: Resistor-0603)
R89  value 100K  [0603]  (hidden comment: Resistor-0603)
R90  value 100K  [0603]  (hidden comment: Resistor-0603)
R91  value 100K  [0603]  (hidden comment: Resistor-0603)
R92  value 10K  [0603]  (hidden comment: Resistor-0603)
R93  value 10K  [0603]  (hidden comment: Resistor-0603)
R94  value 10K  [0603]  (hidden comment: Resistor-0603)
R95  value 3.3K  [0603]  (hidden comment: Resistor-0603)
R96  value 1K  [0603]  (hidden comment: Resistor-0603)
R97  value 10K  [0603]  (hidden comment: Resistor-0603)
R98  value 10K  [0603]  (hidden comment: Resistor-0603)
R99  value 330R  [0603]  (hidden comment: Resistor-0603)
R100  value 100R  [0603]  (hidden comment: Resistor-0603)
R101  value 10K  [0603]  (hidden comment: Resistor-0805)
R102  value 10K  [0603]  (hidden comment: Resistor-0805)
R103  value 1k  [0603]  (hidden comment: Resistor-0603)
R104  value 10K  [0603]  (hidden comment: Resistor-0805)
R105  value 1k  [0603]  (hidden comment: Resistor-0603)
R106  value 1K  [0603]  (hidden comment: Resistor-0805)
R107  value 1K  [0603]  (hidden comment: Resistor-0805)
R108  value 10K  [0603]  (hidden comment: Resistor-0805)
R109  value 1K  [0603]  (hidden comment: Resistor-0805)
R110  value 4.7K  [0603]  (hidden comment: Resistor-0805)
R111  value 4.7K  [0603]  (hidden comment: Resistor-0805)
R112  value 1M  [0603]  (hidden comment: Resistor-0805)
U19  SM2200  [SM2200]  (parts A,B,C of 3)
U20  OPA564AIDWDR  [OPA564AIDWDR]
X4  value 10M  [3225无源晶振]  (hidden comment: 3225无源晶振)

### Ports
INT (out), RST1 (in), SPI_SCK (in), SPI_SI (in), SPI_SO (out), SPISS (in)

### Nets
AFE_VCC: C124.2 C125.2 D5.2(K) D6.2(K) R89.2 U20.2
GND: B1.1(Y) C86.1 C89.1 C90.1 C91.1 C92.1 C93.1 C95.1 C97.2 C98.1 C99.1 C100.1 C101.1 C102.1 C103.2 C104.1 C105.1 C106.1 C108.1 C109.1 C110.1 C111.1 C112.1 C113.1 C114.1 C115.1 C116.1 C117.1 C120.2 C121.2 C122.2 C123.2 C124.1 C125.1 D7.1(A) D8.1(A) L13.1 Q8.1(E) Q9.1(E) Q10.1(E) Q11.1(E) R90.1 R91.1 R92.1 R93.1 R98.1 R104.2 R108.2 U19.7(VS25_DAC) U19.10(VS33_DAC) U19.13(VSS_PLL) U19.17(VSS_IO) U19.19(VSS_CORE) U19.27(VSS_IO) U19.32(VSS_IO) U19.37(VSS_IO) U19.38(VSS_IO) U19.39(VSS_IO) U19.41(VSS_CORE) U19.43(VS25_ADC) U19.46(VS33_ADC) U20.1 X4.2(GND) X4.4(GND)
VDD-3.3: C86.2 C98.2 C99.2 C100.2 C101.2 C108.2 C109.2 C110.2 C111.2 C112.2 C113.2 LED7.1(A) LED8.1(A) R88.2 R101.2 R102.2 U19.9(VD33_DAC) U19.18(VDD_IO) U19.29(VDD_IO) U19.40(VDD_IO) U19.45(VD33_ADC) U20.7
ADC_IN: C107.1 R94.2 U19.1 U19.48(ADC_IN)
AGC_0: R103.2 U19.21(AGC_0)
AGC_1: R105.2 U19.16(AGC_1)
Base: C102.2 R88.1 R90.2 U19.2(+) U19.5(+)
BWSEL: R104.1 U19.26(BWSEL)
DAC_OUT: C88.2 U19.11(DAC_OUT)
INT: R101.1 U19.25(INTERRUPT) ; port INT
RST1: R102.1 U19.24(RESET) ; port RST1
RX_LED: R111.1 U19.23(RX_LED)
SHDN: R108.1 U19.28(SHUTDOWN)
Signal: B1.2(X) C96.1 R96.2
SPI_SCK: U19.35(SPI_SCK) ; port SPI_SCK  [project net SPI3_CLK]
SPI_SI: U19.34(SPI_SI) ; port SPI_SI  [project net SPI3_MOSI]
SPI_SO: U19.33(SPI_SO) ; port SPI_SO  [project net SPI3_MISO]
SPISS: U19.36(SPISS) ; port SPISS  [project net SPI3_NSS]
TX_EN: R92.2 U19.15(TX_EN) U20.4
TX_LED: R110.2 U19.22(TX_LED)
VDD2.5: C90.2 C91.2 C92.2 C93.2 C104.2 C105.2 U19.8(VD25_DAC) U19.12(VREG25) U19.14(VDD_PLL) U19.44(VD25_ADC)
VDD_CORE: C114.2 C115.2 C116.2 C117.2 U19.20(VDD_CORE) U19.42(VDD_CORE)
XIN: C123.1 R112.1 U19.30(XIN) X4.1(OSC1)
XOUT: R109.1 R112.2 U19.31(XOUT)
NetC85_1: C85.1 D5.1(A) D7.2(K) L11.1 R82.2 U20.15
NetC85_2: C85.2 R87.2 U20.6
NetC87_1: C87.1 C94.2 R83.2 U19.4
NetC87_2: C87.2 R85.2 U19.6(-)
NetC88_1: C88.1 R84.1
NetC89_2: C89.2 U19.47(VCM_ADC)
NetC94_1: C94.1 R86.1
NetC95_2: C95.2 R83.1 R84.2 R85.1
NetC96_2: C96.2 D6.1(A) D8.2(K) L11.2
NetC97_1: C97.1 R82.1 R86.2 R87.1
NetC103_1: C103.1 R89.1 R91.2 U20.5
NetC106_2: C106.2 R93.2 U20.9
NetC107_2: C107.2 R97.2 U19.3(-)
NetC118_1: C118.1 C120.1 L12.1 L13.2 R98.2 R99.2 R100.2
NetC118_2: C118.2 R95.1
NetC119_1: C119.1 R96.1
NetC119_2: C119.2 L12.2
NetC121_1: C121.1 R94.1 R95.2 R97.1
NetC122_1: C122.1 R109.2 X4.3(OSC2)
NetLED7_2: LED7.2 R106.2
NetLED8_2: LED8.2 R107.2
NetQ8_2: Q8.2(B) R105.1
NetQ8_3: Q8.3(C) R99.1
NetQ9_2: Q9.2(B) R103.1
NetQ9_3: Q9.3(C) R100.1
NetQ10_2: Q10.2(B) R111.2
NetQ10_3: Q10.3(C) R107.1
NetQ11_2: Q11.2(B) R110.1
NetQ11_3: Q11.3(C) R106.1

Not connected (* = marked no-connect by the designer): U20 3 8 12

### Notes on the sheet
- (in symbol OPA564AIDWDR) -; V+; +; V-

### Library data of the parts
C89-C93 C98-C101 C104 C105 C108-C117 C122 C123 = Capacito
R101 R102 R104 R106-R112 = Resisto
U20 = OPA564AIDWDR: pin to pad: 1>1+10+11+20+13+14; Name: OPA564AIDWDR
B1 = BNC: Name: BNC
LED7 LED8 = LED: Value: LED
Q8-Q11 = BC847: Name: BC847B

## Nets that join several sheets
AFE_VCC: Power (6 pins), SM2200 (6 pins)
GND: MCU (43 pins), Module (24 pins), Power (61 pins), RJ45-1 (35 pins), RJ45-2 (35 pins), SM2200 (64 pins)
VCC-3.3: Power (6 pins), RJ45-1 (C66.2 C68.2 L6.1 L7.1), RJ45-2 (C78.2 C80.2 L9.1 L10.1)
VDD3.3: MCU (30 pins), Module (9 pins), Power (5 pins)
VDD-3.3: Module (5 pins), Power (C57.2 C58.1 U14.1 U14.2), SM2200 (22 pins)
INT: MCU (U1.34), SM2200 (R101.1 U19.25)
INT1: MCU (U1.67), RJ45-1 (R54.2 U16.40)
INT2: MCU (U1.45), RJ45-2 (R74.2 U18.40)
MISO1: MCU (U1.75), RJ45-1 (U16.44)
MISO2: MCU (U1.42), RJ45-2 (U18.44)
MOSI1: MCU (U1.76), RJ45-1 (U16.43)
MOSI2: MCU (U1.43), RJ45-2 (U18.43)
NetR10_2: MCU (U1.81), Module (R10.2 U3.6)
NetR11_1: MCU (U1.78), Module (R11.1)
NetR13_2: MCU (U1.82), Module (R13.2 U3.5)
NetR15_2: MCU (U1.80), Module (R15.2 U4.2 U4.3)
NetR18_1: MCU (U1.77), Module (R18.1)
NetR23_2: MCU (U1.137), Module (R23.2)
NetR24_2: MCU (U1.141), Module (R24.2)
NetR25_2: MCU (U1.140), Module (R25.2)
NetR26_2: MCU (U1.139), Module (R26.2)
NetR27_1: MCU (U1.101), Module (R27.1)
NetR28_1: MCU (U1.100), Module (R28.1)
NetR30_2: MCU (U1.142), Module (R30.2)
NetR38_2: MCU (U1.92), Power (R38.2)
NetR40_2: MCU (U1.103), Power (R40.2)
PWDN1: MCU (U1.66), RJ45-1 (R42.2 U16.45)
PWDN2: MCU (U1.37), RJ45-2 (R63.2 U18.45)
RESET1: MCU (U1.65), RJ45-1 (R53.2 U16.46)
RESET2: MCU (U1.36), RJ45-2 (R73.2 U18.46)
RST1: MCU (U1.35), SM2200 (R102.1 U19.24)
SCLK1: MCU (U1.74), RJ45-1 (U16.42)
SCLK2: MCU (U1.41), RJ45-2 (U18.42)
SCS1: MCU (U1.73), RJ45-1 (R55.2 U16.41)
SCS2: MCU (U1.40), RJ45-2 (R75.2 U18.41)
SPI3_CLK: MCU (U1.111), SM2200 (U19.35)
SPI3_MISO: MCU (U1.112), SM2200 (U19.33)
SPI3_MOSI: MCU (U1.113), SM2200 (U19.34)
SPI3_NSS: MCU (U1.114), SM2200 (U19.36)